# EAGLE schematic RTK_mosaic-X5 (EAGLE 9.6.2)

## Sheet 1 of 2
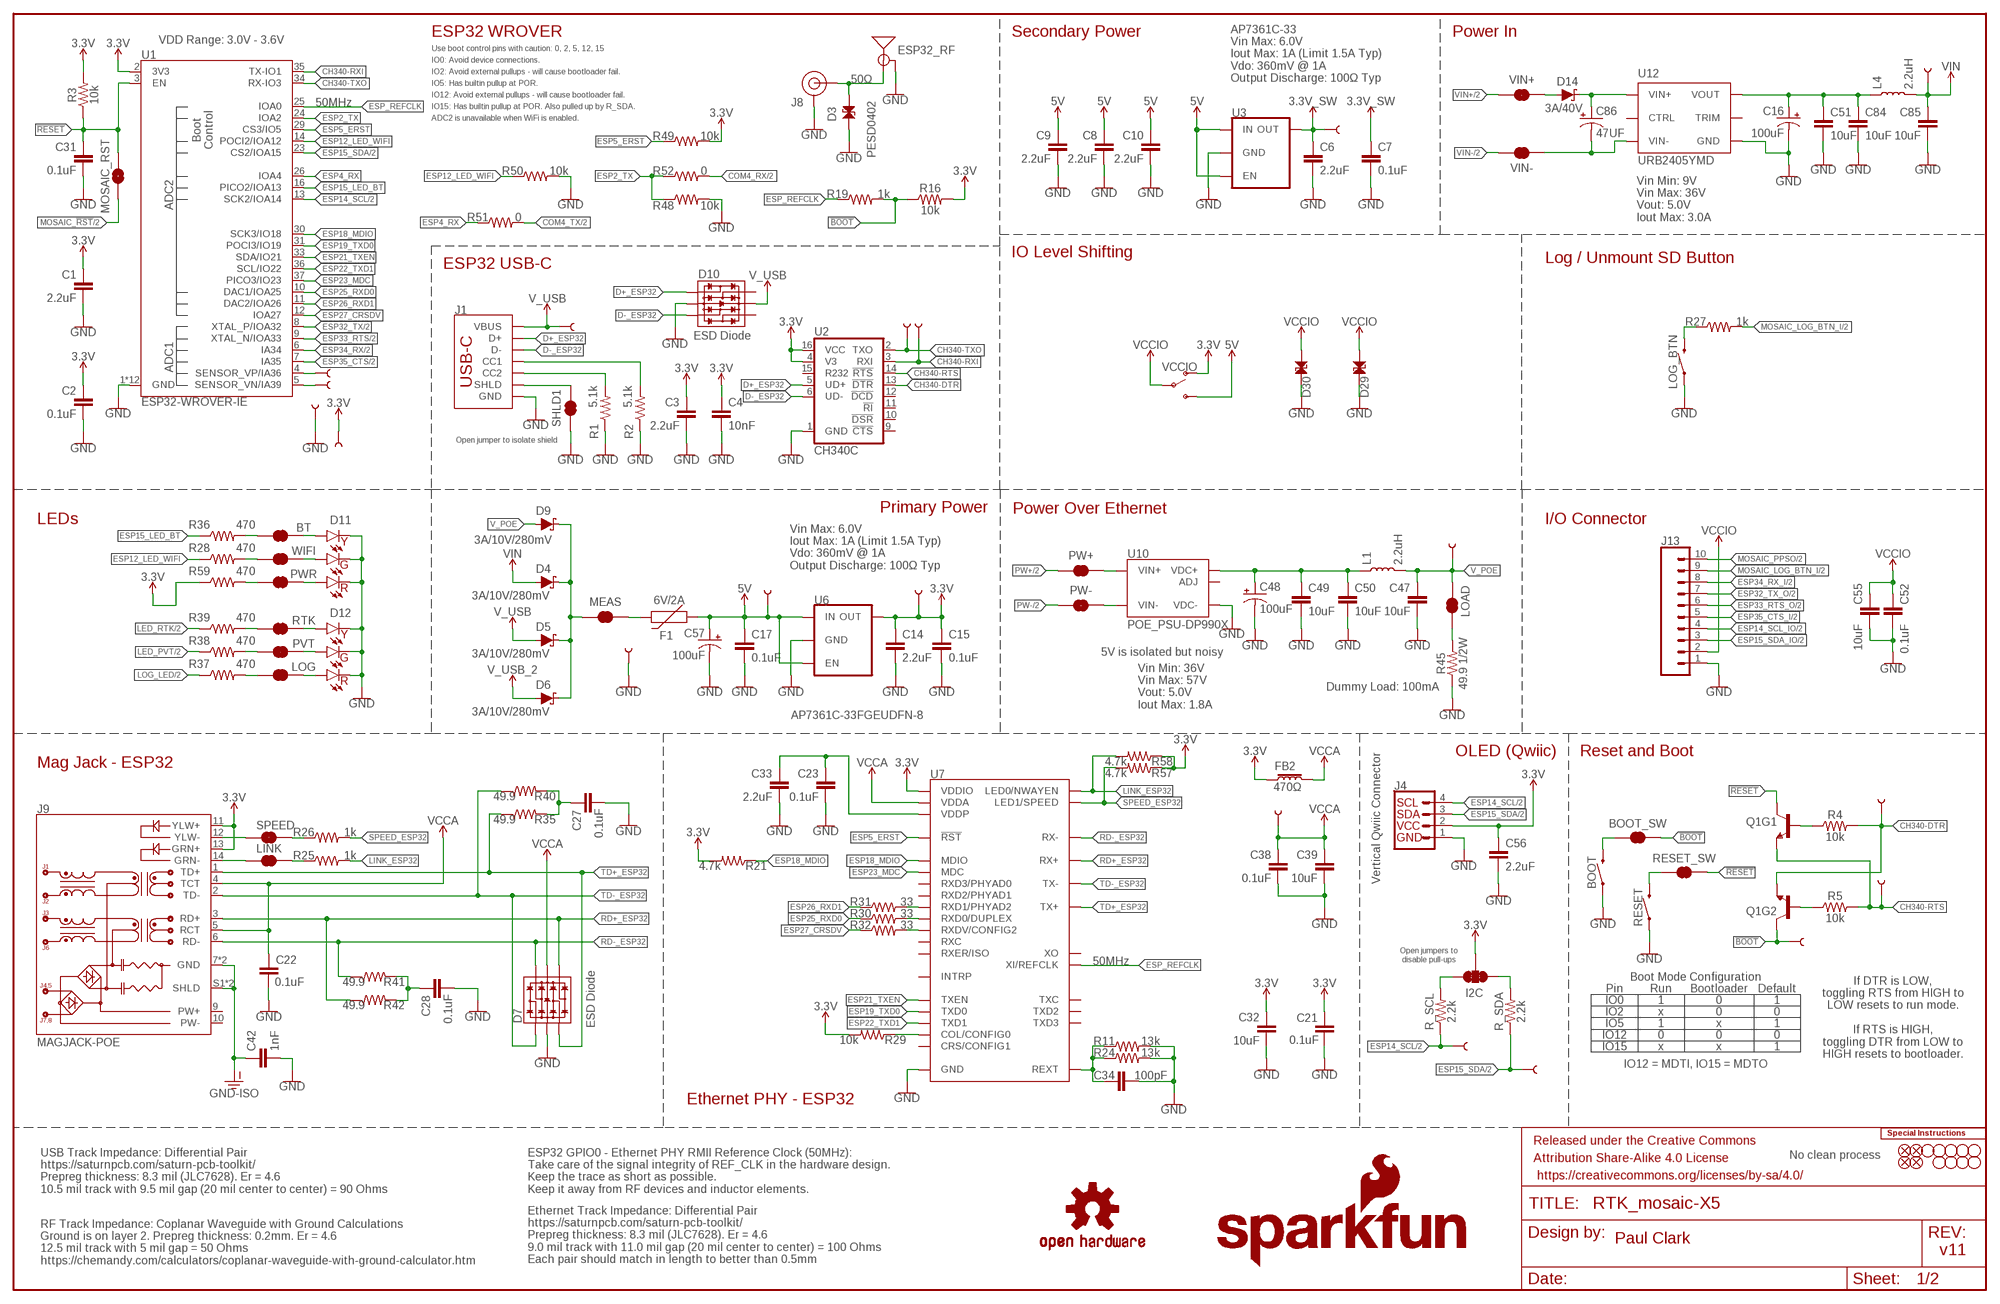
[diagram p0: schematic, sheet 1]

### Parts
3V3  TEST-POINTPOGO_PTH  [1X01_NO_SILK]
3V3_SW  TEST-POINTPOGO_PTH  [1X01_NO_SILK]
5V  TEST-POINTPOGO_PTH  [1X01_NO_SILK]
BOOT  MOMENTARY-SWITCH-SPST-PTH-RIGHT-ANGLE-8-020  [TACTILE_SWITCH_PTH_RA_8-020]
BOOT_SW  JUMPER-SMT_2_NC_TRACE_SILK  [SMT-JUMPER_2_NC_TRACE_SILK]
BT  JUMPER-SMT_2_NC_TRACE_SILK  [SMT-JUMPER_2_NC_TRACE_SILK]
C1  2.2uF  2.2UF-0603-10V-20%  [0603]
C2  0.1uF  0.1UF-0603-25V-5%  [0603]
C3  2.2uF  2.2UF-0603-10V-20%  [0603]
C4  10nF  10NF-0603-50V-10%  [0603]
C6  2.2uF  2.2UF-0603-10V-20%  [0603]
C7  0.1uF  0.1UF-0603-25V-5%  [0603]
C8  2.2uF  2.2UF-0603-10V-20%  [0603]
C9  2.2uF  2.2UF-0603-10V-20%  [0603]
C10  2.2uF  2.2UF-0603-10V-20%  [0603]
C14  2.2uF  2.2UF-0603-10V-20%  [0603]
C15  0.1uF  0.1UF-0603-25V-5%  [0603]
C16  100uF  100UF-POLAR-25V-20%(ELEC)  [PANASONIC_D]
C17  0.1uF  0.1UF-0603-25V-5%  [0603]
C21  0.1uF  0.1UF-0603-25V-5%  [0603]
C22  0.1uF  0.1UF-0603-25V-5%  [0603]
C23  0.1uF  0.1UF-0603-25V-5%  [0603]
C27  0.1uF  0.1UF-0603-25V-5%  [0603]
C28  0.1uF  0.1UF-0603-25V-5%  [0603]
C31  0.1uF  0.1UF-0603-25V-5%  [0603]
C32  10uF  10UF-0603-6.3V-20%  [0603]
C33  2.2uF  2.2UF-0603-10V-20%  [0603]
C34  100pF  100PF-0603-50V-5%  [0603]
C38  0.1uF  0.1UF-0603-25V-5%  [0603]
C39  10uF  10UF-0603-6.3V-20%  [0603]
C42  1nF  1.0NF/1000PF-1206-2KV-10%  [1206]
C47  10uF  10UF-0805-25V-10%  [0805]
C48  100uF  100UF-POLAR-25V-20%(ELEC)  [PANASONIC_D]
C49  10uF  10UF-0805-25V-10%  [0805]
C50  10uF  10UF-0805-25V-10%  [0805]
C51  10uF  10UF-0805-25V-10%  [0805]
C52  0.1uF  0.1UF-0603-25V-5%  [0603]
C55  10uF  10UF-0603-6.3V-20%  [0603]
C56  2.2uF  2.2UF-0603-10V-20%  [0603]
C57  100uF  100UF-POLAR-25V-20%(ELEC)  [PANASONIC_D]
C84  10uF  10UF-0805-25V-10%  [0805]
C85  10uF  10UF-0805-25V-10%  [0805]
C86  47UF  47UF-POLAR-PANASONIC_D-50V-20%  [PANASONIC_D]
D3  PESD0402  PESD0402-0402  [0402]
D4  3A/10V/280mV  DIODE-SCHOTTKY-BAT60A  [SOD-323]
D5  3A/10V/280mV  DIODE-SCHOTTKY-BAT60A  [SOD-323]
D6  3A/10V/280mV  DIODE-SCHOTTKY-BAT60A  [SOD-323]
D7  ESD Diode  TVS_DIODE_ARRAY_DT1042-04SO-7  [SOT-23-6]
D9  3A/10V/280mV  DIODE-SCHOTTKY-BAT60A  [SOD-323]
D10  ESD Diode  TVS_DIODE_ARRAY_DT1042-04SO-7  [SOT-23-6]
D11  Yellow Green Red  LED_TRIPLE-3MM_RIGHT-ANGLE_PTH_YELLOW_GREEN_RED  [CBI_LED_T-3MM_PTH]
D12  Yellow Green Red  LED_TRIPLE-3MM_RIGHT-ANGLE_PTH_YELLOW_GREEN_RED  [CBI_LED_T-3MM_PTH]
D14  3A/40V  DIODE-SCHOTTKY-B340A  [SMA-DIODE]
D29  PESD0402  PESD0402-0402  [0402]
D30  PESD0402  PESD0402-0402  [0402]
DTR  TEST-POINTPOGO_PTH  [1X01_NO_SILK]
ESP1  TEST-POINTPOGO_PTH  [1X01_NO_SILK]
ESP2  TEST-POINTPOGO_PTH  [1X01_NO_SILK]
ESP32_RF  ANTENNA-SMA-GROUNDEDEDGE_RPSMA  [RP-SMA-EDGE]
ESP36  TEST-POINTPOGO_PTH  [1X01_NO_SILK]
ESP39  TEST-POINTPOGO_PTH  [1X01_NO_SILK]
F1  6V/2A  PPTC_6V2A  [1210]
FB2  470Ω  FERRITE_BEAD-0603-470Ω-100MHZ-1A-200MILIΩ  [0603]
FD1  FIDUCIAL1X2  [FIDUCIAL-1X2]
FD2  FIDUCIAL1X2  [FIDUCIAL-1X2]
FD3  FIDUCIAL1X2  [FIDUCIAL-1X2]
FD4  FIDUCIAL1X2  [FIDUCIAL-1X2]
FRAME1  FRAME-LEDGER  [CREATIVE_COMMONS]
GND  TEST-POINTPOGO_PTH  [1X01_NO_SILK]
H1  STAND-OFFTIGHT  [STAND-OFF-TIGHT]
H2  STAND-OFFTIGHT  [STAND-OFF-TIGHT]
H3  STAND-OFFTIGHT  [STAND-OFF-TIGHT]
H4  STAND-OFFTIGHT  [STAND-OFF-TIGHT]
H5  STAND-OFFTIGHT  [STAND-OFF-TIGHT]
H6  STAND-OFFTIGHT  [STAND-OFF-TIGHT]
H7  STAND-OFFTIGHT  [STAND-OFF-TIGHT]
H8  STAND-OFFTIGHT  [STAND-OFF-TIGHT]
H10  STAND-OFFTIGHT  [STAND-OFF-TIGHT]
I2C  JUMPER-SMT_3_2-NC_TRACE_SILK  [SMT-JUMPER_3_2-NC_TRACE_SILK]
J1  USB_C_4-LAYER_PADS  [USB-C-16P_4LAYER-PADS]
J4  Vertical Qwiic Connector  QWIIC_CONNECTOR  [JST04_1MM_VERT]
J8  U.FL2PIN-REDUCED-FOOTPRINT  [U.FL_REDUCED_FOOTPRINT]
J9  MAGJACK-POE  [MAGJACK-SYM_LED]
J13  CONN_10_3.5MM_RA_HEADER  [1X10_SCREW_TERMINAL_3.5MM]
L1  2.2uH  INDUCTOR-0805_WIDE-2.2UH  [0805-WIDE]
L4  2.2uH  INDUCTOR-0805_WIDE-2.2UH  [0805-WIDE]
LINK  JUMPER-SMT_2_NC_TRACE_SILK  [SMT-JUMPER_2_NC_TRACE_SILK]
LOAD  JUMPER-SMT_2_NC_TRACE_SILK  [SMT-JUMPER_2_NC_TRACE_SILK]
LOG  JUMPER-SMT_2_NC_TRACE_SILK  [SMT-JUMPER_2_NC_TRACE_SILK]
LOG_BTN  MOMENTARY-SWITCH-SPST-PTH-RIGHT-ANGLE-8-020  [TACTILE_SWITCH_PTH_RA_8-020]
LOGO1  SPECIAL_INSTRUCTIONS-ORDERING  [ORDERING_INSTRUCTIONS]
LOGO4  OSHW-LOGOS  [OSHW-LOGO-S]
LOGO5  SFE_LOGO_NAME.2_INCH  [SFE_LOGO_NAME_.2]
LOGO6  SFE_LOGO_FLAME.2_INCH  [SFE_LOGO_FLAME_.2]
MEAS  JUMPER-COMBO_2_NC_TRACE  [COMBO-JUMPER_2_NC_TRACE]
MOSAIC_RST  JUMPER-COMBO_2_NO  [COMBO-JUMPER_2_NO]
PVT  JUMPER-SMT_2_NC_TRACE_SILK  [SMT-JUMPER_2_NC_TRACE_SILK]
PW+  JUMPER-COMBO_2_NC_TRACE  [COMBO-JUMPER_2_NC_TRACE]
PW-  JUMPER-COMBO_2_NC_TRACE  [COMBO-JUMPER_2_NC_TRACE]
PWR  JUMPER-SMT_2_NC_TRACE_SILK  [SMT-JUMPER_2_NC_TRACE_SILK]
Q1  TRANS_NPN_DUAL-MBT3904DW1T1  [SC70-6]
R1  5.1k  5.1KOHM5.1KOHM-0603-1/10W-1%  [0603]
R2  5.1k  5.1KOHM5.1KOHM-0603-1/10W-1%  [0603]
R3  10k  10KOHM-0603-1/10W-1%  [0603]
R4  10k  10KOHM-0603-1/10W-1%  [0603]
R5  10k  10KOHM-0603-1/10W-1%  [0603]
R11  13k  13KOHM-0603-1/10W-1%  [0603]
R16  10k  10KOHM-0603-1/10W-1%  [0603]
R19  1k  1KOHM-0603-1/10W-1%  [0603]
R21  4.7k  4.7KOHM-0603-1/10W-1%  [0603]
R24  13k  13KOHM-0603-1/10W-1%  [0603]
R25  1k  1KOHM-0603-1/10W-1%  [0603]
R26  1k  1KOHM-0603-1/10W-1%  [0603]
R27  1k  1KOHM-0603-1/10W-1%  [0603]
R28  470  470OHM-0603-1/10W-1%  [0603]
R29  10k  10KOHM-0603-1/10W-1%  [0603]
R30  33  33OHM-0603-1/10W-1%  [0603]
R31  33  33OHM-0603-1/10W-1%  [0603]
R32  33  33OHM-0603-1/10W-1%  [0603]
R35  49.9  49.9OHM-0603-1/10W-1%  [0603]
R36  470  470OHM-0603-1/10W-1%  [0603]
R37  470  470OHM-0603-1/10W-1%  [0603]
R38  470  470OHM-0603-1/10W-1%  [0603]
R39  470  470OHM-0603-1/10W-1%  [0603]
R40  49.9  49.9OHM-0603-1/10W-1%  [0603]
R41  49.9  49.9OHM-0603-1/10W-1%  [0603]
R42  49.9  49.9OHM-0603-1/10W-1%  [0603]
R45  49.9 1/2W  49.9OHM-1206-1/2W-1%  [1206]
R48  10k  10KOHM-0603-1/10W-1%  [0603]
R49  10k  10KOHM-0603-1/10W-1%  [0603]
R50  10k  10KOHM-0603-1/10W-1%  [0603]
R51  0  0OHM-0603-1/10W  [0603]
R52  0  0OHM-0603-1/10W  [0603]
R57  4.7k  4.7KOHM-0603-1/10W-1%  [0603]
R58  4.7k  4.7KOHM-0603-1/10W-1%  [0603]
R59  470  470OHM-0603-1/10W-1%  [0603]
R_SCL  2.2k  2.2KOHM-0603-1/10W-1%  [0603]
R_SDA  2.2k  2.2KOHM-0603-1/10W-1%  [0603]
RESET  MOMENTARY-SWITCH-SPST-PTH-RIGHT-ANGLE-8-020  [TACTILE_SWITCH_PTH_RA_8-020]
RESET_SW  JUMPER-SMT_2_NC_TRACE_SILK  [SMT-JUMPER_2_NC_TRACE_SILK]
RTK  JUMPER-SMT_2_NC_TRACE_SILK  [SMT-JUMPER_2_NC_TRACE_SILK]
RTS  TEST-POINTPOGO_PTH  [1X01_NO_SILK]
RX  TEST-POINTPOGO_PTH  [1X01_NO_SILK]
SCL2  TEST-POINTPOGO_PTH  [1X01_NO_SILK]
SDA2  TEST-POINTPOGO_PTH  [1X01_NO_SILK]
SHLD1  JUMPER-SMT_2_NC_TRACE_SILK  [SMT-JUMPER_2_NC_TRACE_SILK]
SPEED  JUMPER-SMT_2_NC_TRACE_SILK  [SMT-JUMPER_2_NC_TRACE_SILK]
TP_BOOT  TEST-POINTPOGO_PTH  [1X01_NO_SILK]
TX  TEST-POINTPOGO_PTH  [1X01_NO_SILK]
U1  ESP32-WROVER-IE  ESP32-WROVER-E/IE_IE-N16R8  [ESP32-WROVER-E/IE]
U2  CH340C  [SO016]
U3  AP7361C-33FGEUDFN-8  [UDFN-8]
U6  AP7361C-33FGEUDFN-8  [UDFN-8]
U7  KSZ8041NLI  KSZ8041NL  [MLF55Q-32LD]
U10  POE_PSU-DP990X  [DP990X]
U12  URB2405YMD  URB_YMD-15WR3__URB2405YMD-15WR3  [URB_YMD-15WR3]
VCCA  TEST-POINTPOGO_PTH  [1X01_NO_SILK]
VCCIO  SWITCH-SPDT-SMD-AYZ0202  [SWITCH_DPDT_SMD_AYZ0202]
VIN  TEST-POINTPOGO_PTH  [1X01_NO_SILK]
VIN+  JUMPER-COMBO_2_NC_TRACE  [COMBO-JUMPER_2_NC_TRACE]
VIN-  JUMPER-COMBO_2_NC_TRACE  [COMBO-JUMPER_2_NC_TRACE]
VPOE  TEST-POINTPOGO_PTH  [1X01_NO_SILK]
VUSB  TEST-POINTPOGO_PTH  [1X01_NO_SILK]
WIFI  JUMPER-SMT_2_NC_TRACE_SILK  [SMT-JUMPER_2_NC_TRACE_SILK]

### Nets
3.3V: 3V3.1 C1.1 C2.1 C3.1 C4.1 C14.1 C15.1 C21.1 C32.1 C56.1 ESP2.1 FB2.1 I2C.2 J4.2 J9.11(YLW+) J9.13(GRN+) R3.2 R16.2 R21.2 R29.2 R49.2 R57.1 R58.1 R59.1 U1.2(3V3) U2.4(V3) U2.16(VCC) U6.1(OUT) U7.17(VDDIO) VCCIO.1(O) ; also sheet 2
3.3V_SW: 3V3_SW.1 C6.1 C7.1 U3.1(OUT) ; also sheet 2
5V: 5V.1 C8.1 C9.1 C10.1 C17.1 C57.+ F1.1 U3.5(EN) U3.8(IN) U6.5(EN) U6.8(IN) VCCIO.3(S) ; also sheet 2
5V_RAW: C48.+ C49.1 C50.1 L1.1 U10.1(VDC+) U10.2(VDC+)
5V_RAW1: C16.+ C51.1 C84.1 L4.1 U12.4(VOUT)
!BOOT!: BOOT_SW.1 Q1.6(C) R16.1 R19.2 TP_BOOT.1
!RESET!: C31.1 MOSAIC_RST.2 MOSAIC_RST.4 Q1.3(C) R3.1 RESET_SW.1 U1.3(EN)
CH340-DTR: DTR.1 Q1.1(E) R4.2 U2.13(!DTR)
CH340-RTS: Q1.4(E) R5.2 RTS.1 U2.14(!RTS)
CH340-RXI: TX.1 U1.35(TX-IO1) U2.3(RXI)
CH340-TXO: RX.1 U1.34(RX-IO3) U2.2(TXO)
COM4_RX: R52.2 ; also sheet 2
COM4_TX: R51.2 ; also sheet 2
D+_ESP32: D10.1(IO1) J1.A6(D+) J1.B6(D+) U2.5(UD+)
D-_ESP32: D10.3(IO2) J1.A7(D-) J1.B7(D-) U2.6(UD-)
ESP2_TX: R48.1 R52.1 U1.24(IOA2)
ESP4_RX: R51.1 U1.26(IOA4)
ESP5_ERST: R49.1 U1.29(CS3/IO5) U7.32(!RST!)
ESP12_LED_WIFI: R28.1 R50.1 U1.14(POCI2/IOA12)
ESP14_SCL: J4.4 R_SCL.1 SCL2.1 U1.13(SCK2/IOA14) ; also sheet 2
ESP14_SCL_IO: J13.4 ; also sheet 2
ESP15_LED_BT: R36.1 U1.16(PICO2/IOA13)
ESP15_SDA: J4.3 R_SDA.1 SDA2.1 U1.23(CS2/IOA15) ; also sheet 2
ESP15_SDA_IO: J13.3 ; also sheet 2
ESP18_MDIO: R21.1 U1.30(SCK3/IO18) U7.11(MDIO)
ESP19_TXD0: U1.31(POCI3/IO19) U7.24(TXD0)
ESP21_TXEN: U1.33(SDA/IO21) U7.23(TXEN)
ESP22_TXD1: U1.36(SCL/IO22) U7.25(TXD1)
ESP23_MDC: U1.37(PICO3/IO23) U7.12(MDC)
ESP25_RXD0: R30.1 U1.10(DAC1/IOA25)
ESP26_RXD1: R31.1 U1.11(DAC2/IOA26)
ESP27_CRSDV: R32.1 U1.12(IOA27)
ESP32_RF: D3.1 ESP32_RF.SIG(SIGNAL) J8.FEED(SIGNAL)
ESP32_TX: U1.8(XTAL_P/IOA32) ; also sheet 2
ESP32_TX_O: J13.7 ; also sheet 2
ESP33_RTS: U1.9(XTAL_N/IOA33) ; also sheet 2
ESP33_RTS_O: J13.6 ; also sheet 2
ESP34_RX: U1.6(IA34) ; also sheet 2
ESP34_RX_I: J13.8 ; also sheet 2
ESP35_CTS: U1.7(IA35) ; also sheet 2
ESP35_CTS_I: J13.5 ; also sheet 2
ESP36: ESP36.1 U1.4(SENSOR_VP/IA36)
ESP39: ESP39.1 U1.5(SENSOR_VN/IA39)
ESP_REFCLK: R19.1 U1.25(IOA0) U7.9(XI/REFCLK)
GND: BOOT.1 C1.2 C2.2 C3.2 C4.2 C6.2 C7.2 C8.2 C9.2 C10.2 C14.2 C15.2 C16.- C17.2 C21.2 C22.2 C23.2 C27.2 C28.2 C31.2 C32.2 C33.2 C34.2 C38.2 C39.2 C42.2 C47.2 C48.- C49.2 C50.2 C51.2 C52.2 C55.2 C56.2 C57.- C84.2 C85.2 D3.2 D7.2(VSS) D10.2(VSS) D11.CATHODE_1(YELLOW_CATHODE) D11.CATHODE_2(GREEN_CATHODE) D11.CATHODE_3(RED_CATHODE) D12.CATHODE_1(YELLOW_CATHODE) D12.CATHODE_2(GREEN_CATHODE) D12.CATHODE_3(RED_CATHODE) D29.2 D30.2 ESP1.1 ESP32_RF.GND@0(GND) ESP32_RF.GND@1(GND) ESP32_RF.GND@2(GND) ESP32_RF.GND@3(GND) GND.1 J1.GND J1.GND2(GND) J4.1 J8.1(GND) J8.2(GND) J13.1 LOG_BTN.1 R1.1 R2.1 R11.2 R24.2 R45.1 R48.2 R50.2 RESET.1 SHLD1.1 U1.1(GND) U1.15(GND) U1.38(GND) U1.GND U1.GNDT1(GND) U1.GNDT2(GND) U1.GNDT3(GND) U1.GNDT4(GND) U1.GNDT5(GND) U1.GNDT6(GND) U1.GNDT7(GND) U1.GNDT8(GND) U2.1(GND) U3.4(GND) U3.EP(GND) U6.4(GND) U6.EP(GND) U7.1(GND) U7.GND U10.3(VDC-) U12.6(GND) ; also sheet 2
GND-ISO: C42.1 J9.7(GND) J9.8(GND) J9.S1(SHLD) J9.S2(SHLD) ; also sheet 2
LED_PVT: R38.1 ; also sheet 2
LED_RTK: R39.1 ; also sheet 2
LINK_ESP32: R25.2 R58.2 U7.30(LED0/NWAYEN)
LOG_LED: R37.1 ; also sheet 2
MEAS: D4.C D5.C D6.C D9.C MEAS.2 MEAS.4
MOSAIC_!RST!: MOSAIC_RST.1 MOSAIC_RST.3 ; also sheet 2
MOSAIC_LOG_BTN_I: J13.9 R27.2 ; also sheet 2
MOSAIC_PPSO: J13.10 ; also sheet 2
N$1: J1.B5(CC2) R1.2
N$2: J1.A5(CC1) R2.2
N$3: J9.14(GRN-) LINK.1
N$4: Q1.2(B) R5.1
N$5: Q1.5(B) R4.1
N$7: J9.12(YLW-) SPEED.1
N$10: F1.2 MEAS.1 MEAS.3
N$11: LOG_BTN.2 R27.1
N$12: R26.1 SPEED.2
N$14: I2C.3 R_SCL.2
N$15: I2C.1 R_SDA.2
N$16: LOG.2 R37.2
N$17: D12.ANODE_3(RED_ANODE) LOG.1
N$18: D11.ANODE_2(GREEN_ANODE) WIFI.1
N$19: C27.1 R35.2 R40.2
N$20: C28.1 R41.2 R42.2
N$21: LINK.2 R25.1
N$22: BT.1 D11.ANODE_1(YELLOW_ANODE)
N$23: C23.1 C33.1 U7.2(VDDP)
N$24: C34.1 R11.1 R24.1 U7.10(REXT)
N$25: R29.1 U7.28(COL/CONFIG0)
N$26: BT.2 R36.2
N$27: LOAD.1 R45.2
N$28: RESET.2 RESET_SW.2
N$29: BOOT.2 BOOT_SW.2
N$30: R30.2 U7.16(RXD0/DUPLEX)
N$31: R31.2 U7.15(RXD1/PHYAD2)
N$32: R28.2 WIFI.2
N$35: D12.ANODE_2(GREEN_ANODE) PVT.1
N$36: D12.ANODE_1(YELLOW_ANODE) RTK.1
N$37: R39.2 RTK.2
N$38: PVT.2 R38.2
N$39: R32.2 U7.18(RXDV/CONFIG2)
N$44: PWR.2 R59.2
N$45: D11.ANODE_3(RED_ANODE) PWR.1
PW1+: PW+.1 PW+.3 U10.5(VIN+) U10.6(VIN+)
PW1-: PW-.1 PW-.3 U10.7(VIN-) U10.8(VIN-)
PW+: PW+.2 PW+.4 ; also sheet 2
PW-: PW-.2 PW-.4 ; also sheet 2
RD+_ESP32: D7.4(IO3) J9.3(RD+) R42.1 U7.5(RX+)
RD-_ESP32: D7.6(IO4) J9.6(RD-) R41.1 U7.4(RX-)
SHIELD: J1.SHLD1(SHLD) J1.SHLD2(SHLD) J1.SHLD3(SHLD) J1.SHLD4(SHLD) SHLD1.2
SPEED_ESP32: R26.2 R57.2 U7.31(LED1/SPEED)
TD+_ESP32: D7.3(IO2) J9.1(TD+) R35.1 U7.7(TX+)
TD-_ESP32: D7.1(IO1) J9.2(TD-) R40.1 U7.6(TX-)
V_POE: C47.1 D9.A L1.2 LOAD.2 VPOE.1
V_USB: D5.A D10.5(VCC) J1.VBUS1(VBUS) J1.VBUS2(VBUS) VUSB.1
V_USB_2: D6.A ; also sheet 2
VCCA: C22.1 C38.1 C39.1 D7.5(VCC) FB2.2 J9.4(TCT) J9.5(RCT) U7.3(VDDA) VCCA.1
VCCIO: C52.1 C55.1 D29.1 D30.1 J13.2 VCCIO.2(P) ; also sheet 2
VIN: C85.1 D4.A L4.2 VIN.1
VIN1+: D14.A VIN+.1 VIN+.3
VIN1-: C86.- U12.2(VIN-) VIN-.2 VIN-.4
VIN2+: C86.+ D14.C U12.3(VIN+)
VIN+: VIN+.2 VIN+.4 ; also sheet 2
VIN-: VIN-.1 VIN-.3 ; also sheet 2
Unconnected: D10.4(IO3) D10.6(IO4) J9.9(PW+) J9.10(PW-) U2.9(!CTS) U2.10(!DSR) U2.11(!RI) U2.12(!DCD) U2.15(R232) U7.8(XO) U7.13(RXD3/PHYAD0) U7.14(RXD2/PHYAD1) U7.19(RXC) U7.20(RXER/ISO) U7.21(INTRP) U7.22(TXC) U7.26(TXD2) U7.27(TXD3) U7.29(CRS/CONFIG1) U10.4(ADJ) U12.1(CTRL) U12.5(TRIM)

### Notes on the sheet
- Secondary Power | Power In
- VDD Range: 3.0V - 3.6V | ESP32 WROVER
- Use boot control pins with caution: 0, 2, 5, 12, 15
- IO0: Avoid device connections.
- IO2: Avoid external pullups - will cause bootloader fail.
- AP7361C-33
  Vin Max: 6.0V
  Iout Max: 1A (Limit 1.5A Typ)
  Vdo: 360mV @ 1A
  Output Discharge: 100Ω Typ
- IO5: Has builtin pullup at POR. | 50Ω
- IO12: Avoid external pullups - will cause bootloader fail.
- 50MHz | IO15: Has builtin pullup at POR. Also pulled up by R_SDA.
- ADC2 is unavailable when WiFi is enabled.
- Vin Min: 9V
  Vin Max: 36V
  Vout: 5.0V
  Iout Max: 3.0A
- IO Level Shifting
- Log / Unmount SD Button
- ESP32 USB-C
- Open jumper to isolate shield
- Primary Power | Power Over Ethernet
- LEDs | I/O Connector
- Vin Max: 6.0V
  Iout Max: 1A (Limit 1.5A Typ)
  Vdo: 360mV @ 1A
  Output Discharge: 100Ω Typ
- 5V is isolated but noisy
- Dummy Load: 100mA
- Vin Min: 36V
  Vin Max: 57V
  Vout: 5.0V
  Iout Max: 1.8A
- OLED (Qwiic) | Reset and Boot
- Mag Jack - ESP32
- Open jumpers to
  disable pull-ups
- 50MHz
- Boot Mode Configuration
- If DTR is LOW,
  toggling RTS from HIGH to
  LOW resets to run mode.
  
  If RTS is HIGH,
  toggling DTR from LOW to
  HIGH resets to bootloader.
- Pin | Run | Bootloader | Default
- IO0 | 1 | 0 | 1
- IO2 | x | 0 | 0
- IO5 | 1 | x | 1
- IO12 | 0 | 0 | 0
- IO15 | x | x | 1
- IO12 = MDTI, IO15 = MDTO
- Ethernet PHY - ESP32
- USB Track Impedance: Differential Pair
  https://saturnpcb.com/saturn-pcb-toolkit/
  Prepreg thickness: 8.3 mil (JLC7628). Er = 4.6
  10.5 mil track with 9.5 mil gap (20 mil center to center) = 90 Ohms
- ESP32 GPIO0 - Ethernet PHY RMII Reference Clock (50MHz):
  Take care of the signal integrity of REF_CLK in the hardware design.
  Keep the trace as short as possible.
  Keep it away from RF devices and inductor elements.
- No clean process
- Ethernet Track Impedance: Differential Pair
  https://saturnpcb.com/saturn-pcb-toolkit/
  Prepreg thickness: 8.3 mil (JLC7628). Er = 4.6
  9.0 mil track with 11.0 mil gap (20 mil center to center) = 100 Ohms
  Each pair should match in length to better than 0.5mm
- Paul Clark
- v11
- RF Track Impedance: Coplanar Waveguide with Ground Calculations
  Ground is on layer 2. Prepreg thickness: 0.2mm. Er = 4.6
  12.5 mil track with 5 mil gap = 50 Ohms
  https://chemandy.com/calculators/coplanar-waveguide-with-ground-calculator.htm

## Sheet 2 of 2
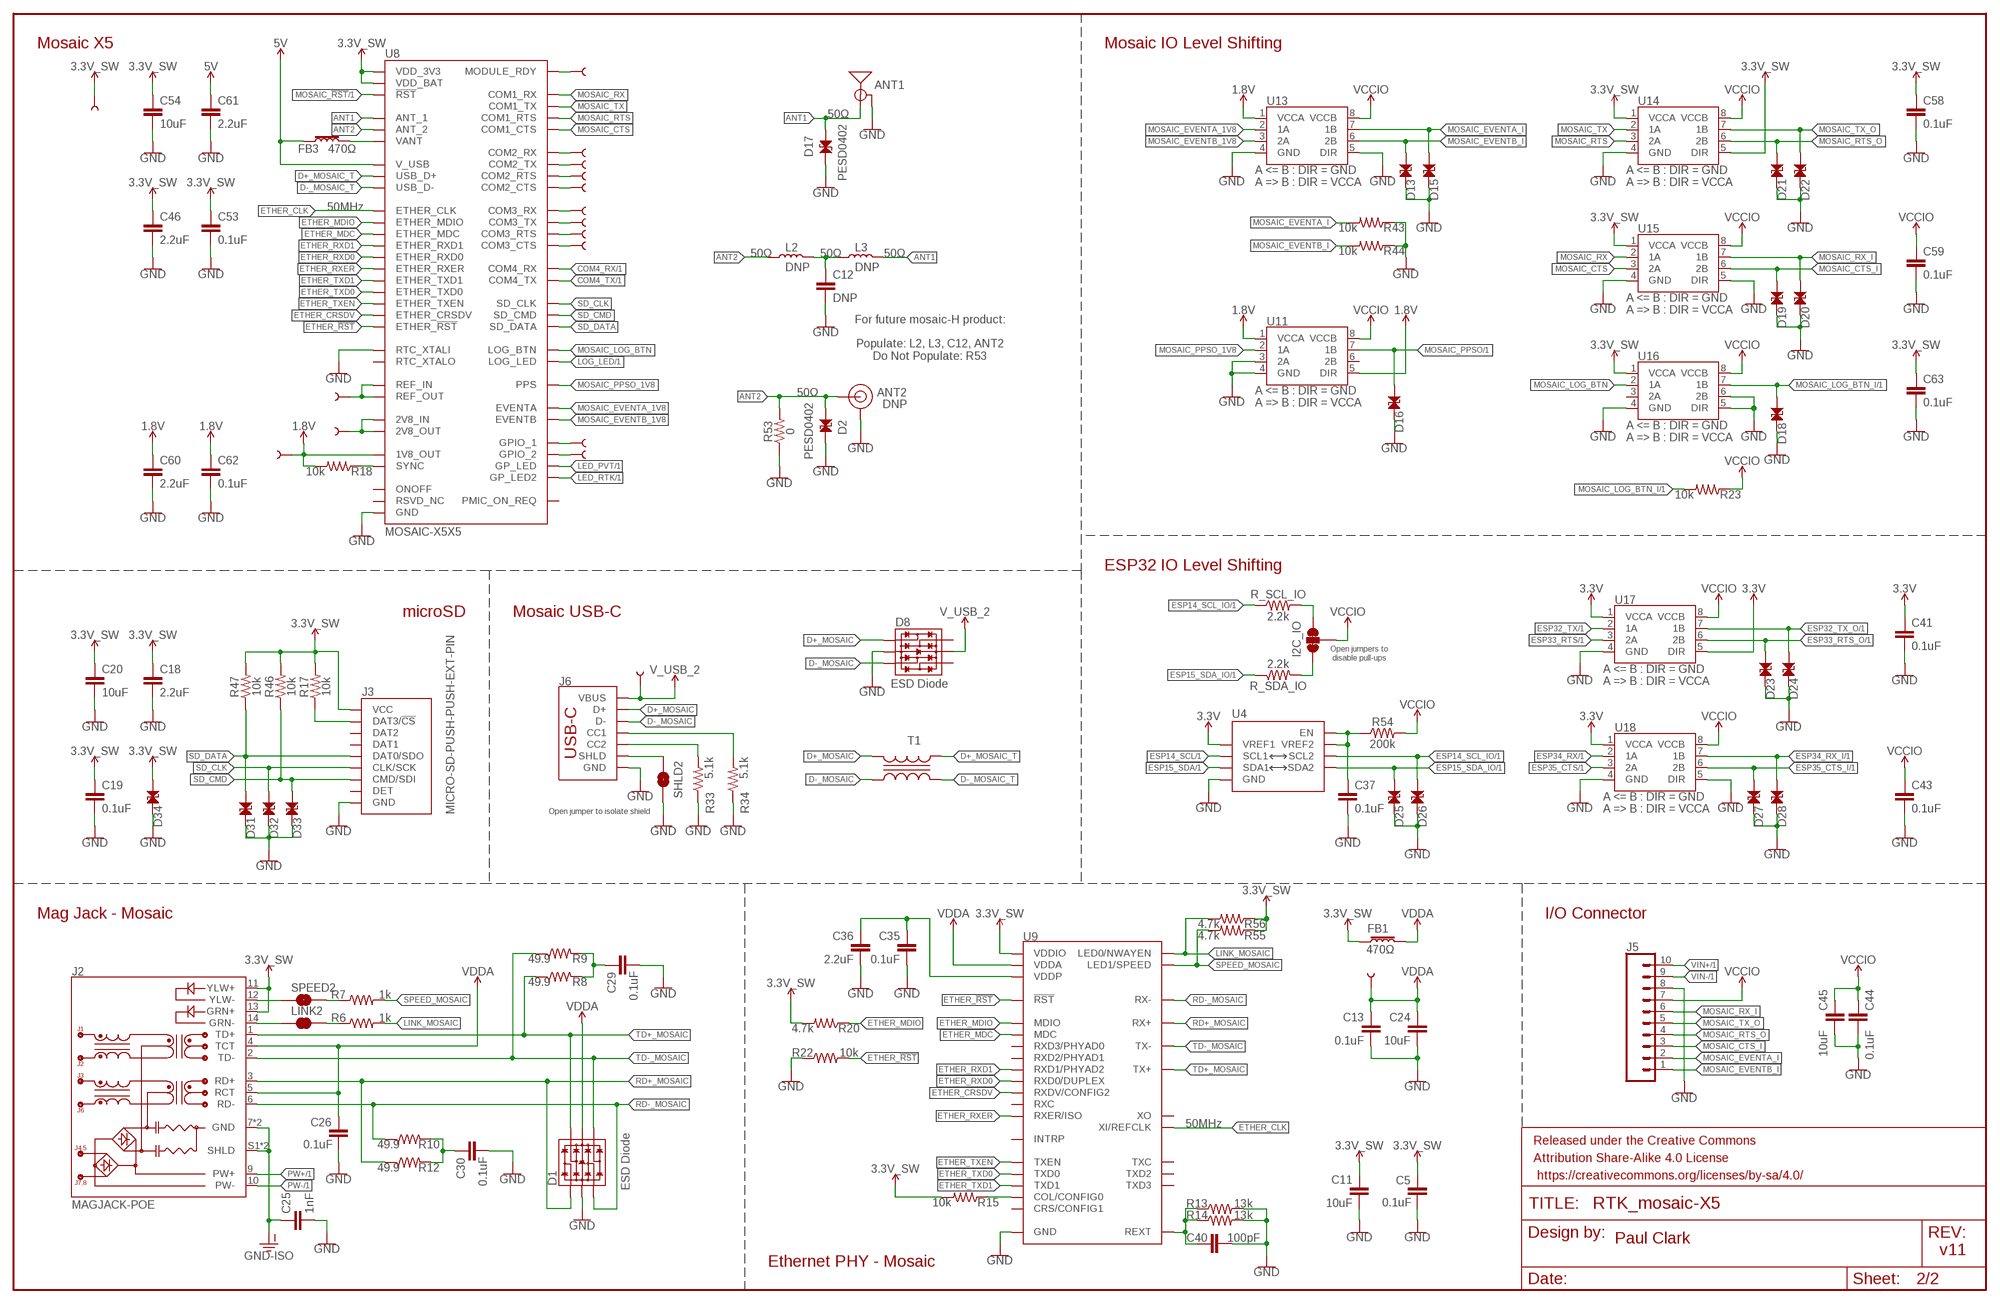
[diagram p1: schematic, sheet 2]

### Parts
1V8  TEST-POINTPOGO_PTH  [1X01_NO_SILK]
2V8  TEST-POINTPOGO_PTH  [1X01_NO_SILK]
ANT1  ANTENNA-SMA-GROUNDEDEDGE_SMA  [SMA-EDGE]
ANT2  DNP  U.FL2PIN-REDUCED__DNP_NO_CREAM  [U.FL_REDUCED_FOOTPRINT__NO_CREAM]
C5  0.1uF  0.1UF-0603-25V-5%  [0603]
C11  10uF  10UF-0603-6.3V-20%  [0603]
C12  DNP  DNP-0603_NO_CREAM  [0603_NO_CREAM]
C13  0.1uF  0.1UF-0603-25V-5%  [0603]
C18  2.2uF  2.2UF-0603-10V-20%  [0603]
C19  0.1uF  0.1UF-0603-25V-5%  [0603]
C20  10uF  10UF-0603-6.3V-20%  [0603]
C24  10uF  10UF-0603-6.3V-20%  [0603]
C25  1nF  1.0NF/1000PF-1206-2KV-10%  [1206]
C26  0.1uF  0.1UF-0603-25V-5%  [0603]
C29  0.1uF  0.1UF-0603-25V-5%  [0603]
C30  0.1uF  0.1UF-0603-25V-5%  [0603]
C35  0.1uF  0.1UF-0603-25V-5%  [0603]
C36  2.2uF  2.2UF-0603-10V-20%  [0603]
C37  0.1uF  0.1UF-0603-25V-5%  [0603]
C40  100pF  100PF-0603-50V-5%  [0603]
C41  0.1uF  0.1UF-0603-25V-5%  [0603]
C43  0.1uF  0.1UF-0603-25V-5%  [0603]
C44  0.1uF  0.1UF-0603-25V-5%  [0603]
C45  10uF  10UF-0603-6.3V-20%  [0603]
C46  2.2uF  2.2UF-0603-10V-20%  [0603]
C53  0.1uF  0.1UF-0603-25V-5%  [0603]
C54  10uF  10UF-0603-6.3V-20%  [0603]
C58  0.1uF  0.1UF-0603-25V-5%  [0603]
C59  0.1uF  0.1UF-0603-25V-5%  [0603]
C60  2.2uF  2.2UF-0603-10V-20%  [0603]
C61  2.2uF  2.2UF-0603-10V-20%  [0603]
C62  0.1uF  0.1UF-0603-25V-5%  [0603]
C63  0.1uF  0.1UF-0603-25V-5%  [0603]
COM2_CTS  TEST-POINTPOGO_PTH  [1X01_NO_SILK]
COM2_RTS  TEST-POINTPOGO_PTH  [1X01_NO_SILK]
COM2_RX  TEST-POINTPOGO_PTH  [1X01_NO_SILK]
COM2_TX  TEST-POINTPOGO_PTH  [1X01_NO_SILK]
COM3_CTS  TEST-POINTPOGO_PTH  [1X01_NO_SILK]
COM3_RTS  TEST-POINTPOGO_PTH  [1X01_NO_SILK]
COM3_RX  TEST-POINTPOGO_PTH  [1X01_NO_SILK]
COM3_TX  TEST-POINTPOGO_PTH  [1X01_NO_SILK]
D1  ESD Diode  TVS_DIODE_ARRAY_DT1042-04SO-7  [SOT-23-6]
D2  PESD0402  PESD0402-0402  [0402]
D8  ESD Diode  TVS_DIODE_ARRAY_DT1042-04SO-7  [SOT-23-6]
D13  PESD0402  PESD0402-0402  [0402]
D15  PESD0402  PESD0402-0402  [0402]
D16  PESD0402  PESD0402-0402  [0402]
D17  PESD0402  PESD0402-0402  [0402]
D18  PESD0402  PESD0402-0402  [0402]
D19  PESD0402  PESD0402-0402  [0402]
D20  PESD0402  PESD0402-0402  [0402]
D21  PESD0402  PESD0402-0402  [0402]
D22  PESD0402  PESD0402-0402  [0402]
D23  PESD0402  PESD0402-0402  [0402]
D24  PESD0402  PESD0402-0402  [0402]
D25  PESD0402  PESD0402-0402  [0402]
D26  PESD0402  PESD0402-0402  [0402]
D27  PESD0402  PESD0402-0402  [0402]
D28  PESD0402  PESD0402-0402  [0402]
D31  PESD0402  PESD0402-0402  [0402]
D32  PESD0402  PESD0402-0402  [0402]
D33  PESD0402  PESD0402-0402  [0402]
D34  PESD0402  PESD0402-0402  [0402]
FB1  470Ω  FERRITE_BEAD-0603-470Ω-100MHZ-1A-200MILIΩ  [0603]
FB3  470Ω  FERRITE_BEAD-0603-470Ω-100MHZ-1A-200MILIΩ  [0603]
FRAME3  FRAME-LEDGERNO_FOOTPRINT  [DUMMY]
GPIO_1  TEST-POINTPOGO_PTH  [1X01_NO_SILK]
GPIO_2  TEST-POINTPOGO_PTH  [1X01_NO_SILK]
I2C_IO  JUMPER-SMT_3_2-NC_TRACE_SILK  [SMT-JUMPER_3_2-NC_TRACE_SILK]
J2  MAGJACK-POE  [MAGJACK-SYM_LED]
J3  MICRO-SD-PUSH-PUSH-EXT-PIN  [MICROSD-EXTERNALPIN]
J5  CONN_10_3.5MM_RA_HEADER  [1X10_SCREW_TERMINAL_3.5MM]
J6  USB_C_4-LAYER_PADS  [USB-C-16P_4LAYER-PADS]
L2  DNP  DNP-0603_NO-CREAM  [0603_NO-CREAM]
L3  DNP  DNP-0603_NO-CREAM  [0603_NO-CREAM]
LINK2  JUMPER-SMT_2_NC_TRACE_SILK  [SMT-JUMPER_2_NC_TRACE_SILK]
R6  1k  1KOHM-0603-1/10W-1%  [0603]
R7  1k  1KOHM-0603-1/10W-1%  [0603]
R8  49.9  49.9OHM-0603-1/10W-1%  [0603]
R9  49.9  49.9OHM-0603-1/10W-1%  [0603]
R10  49.9  49.9OHM-0603-1/10W-1%  [0603]
R12  49.9  49.9OHM-0603-1/10W-1%  [0603]
R13  13k  13KOHM-0603-1/10W-1%  [0603]
R14  13k  13KOHM-0603-1/10W-1%  [0603]
R15  10k  10KOHM-0603-1/10W-1%  [0603]
R17  10k  10KOHM-0603-1/10W-1%  [0603]
R18  10k  10KOHM-0603-1/10W-1%  [0603]
R20  4.7k  4.7KOHM-0603-1/10W-1%  [0603]
R22  10k  10KOHM-0603-1/10W-1%  [0603]
R23  10k  10KOHM-0603-1/10W-1%  [0603]
R33  5.1k  5.1KOHM5.1KOHM-0603-1/10W-1%  [0603]
R34  5.1k  5.1KOHM5.1KOHM-0603-1/10W-1%  [0603]
R43  10k  10KOHM-0603-1/10W-1%  [0603]
R44  10k  10KOHM-0603-1/10W-1%  [0603]
R46  10k  10KOHM-0603-1/10W-1%  [0603]
R47  10k  10KOHM-0603-1/10W-1%  [0603]
R53  0  0OHM-0603-1/10W  [0603]
R54  200k  200KOHM-0603-1/10W-1%  [0603]
R55  4.7k  4.7KOHM-0603-1/10W-1%  [0603]
R56  4.7k  4.7KOHM-0603-1/10W-1%  [0603]
R_SCL_IO  2.2k  2.2KOHM-0603-1/10W-1%  [0603]
R_SDA_IO  2.2k  2.2KOHM-0603-1/10W-1%  [0603]
RDY  TEST-POINTPOGO_PTH  [1X01_NO_SILK]
RDY1  TEST-POINTPOGO_PTH  [1X01_NO_SILK]
REF  TEST-POINTPOGO_PTH  [1X01_NO_SILK]
SHLD2  JUMPER-SMT_2_NC_TRACE_SILK  [SMT-JUMPER_2_NC_TRACE_SILK]
SPEED2  JUMPER-SMT_2_NC_TRACE_SILK  [SMT-JUMPER_2_NC_TRACE_SILK]
T1  TRANSFORMER0508  [RFCMF1220100M4T]
U4  PCA9306VSSOP_8PIN  [VSSOP_8PIN]
U8  MOSAIC-X5X5  [MOSAIC_LGA]
U9  KSZ8041NLI  KSZ8041NL  [MLF55Q-32LD]
U11  74LVC2T45DC  [VSSOP8_(SOT765-1)]
U13  74LVC2T45DC  [VSSOP8_(SOT765-1)]
U14  74LVC2T45DC  [VSSOP8_(SOT765-1)]
U15  74LVC2T45DC  [VSSOP8_(SOT765-1)]
U16  74LVC2T45DC  [VSSOP8_(SOT765-1)]
U17  74LVC2T45DC  [VSSOP8_(SOT765-1)]
U18  74LVC2T45DC  [VSSOP8_(SOT765-1)]
VDDA  TEST-POINTPOGO_PTH  [1X01_NO_SILK]
VUSB2  TEST-POINTPOGO_PTH  [1X01_NO_SILK]

### Nets
1.8V: 1V8.1 C60.1 C62.1 R18.2 U8.AC4(1V8_OUT) U11.1(VCCA) U11.5(DIR) U13.1(VCCA)
2V8: 2V8.1 U8.M23(2V8_IN) U8.N23(2V8_OUT)
3.3V: C41.1 U4.P2(VREF1) U17.1(VCCA) U17.5(DIR) U18.1(VCCA) ; also sheet 1
3.3V_SW: C5.1 C11.1 C18.1 C19.1 C20.1 C46.1 C53.1 C54.1 C58.1 C63.1 D34.1 FB1.1 J2.11(YLW+) J2.13(GRN+) J3.4(VCC) R15.2 R17.2 R20.2 R46.2 R47.2 R55.1 R56.1 RDY1.1 U8.A18(VDD_3V3) U8.A19(VDD_3V3) U8.A20(VDD_3V3) U8.B8(VDD_BAT) U8.B18(VDD_3V3) U8.B19(VDD_3V3) U8.B20(VDD_3V3) U8.C18(VDD_3V3) U8.C19(VDD_3V3) U8.C20(VDD_3V3) U9.17(VDDIO) U14.1(VCCA) U14.5(DIR) U15.1(VCCA) U16.1(VCCA) ; also sheet 1
5V: C61.1 FB3.1 U8.A8(V_USB) ; also sheet 1
ANT1: ANT1.SIG(SIGNAL) D17.1 L3.2 U8.AC20(ANT_1)
ANT2: ANT2.FEED(SIGNAL) D2.1 L2.1 R53.2 U8.V23(ANT_2)
COM2_CTS: COM2_CTS.1 U8.J1(COM2_CTS)
COM2_RTS: COM2_RTS.1 U8.G1(COM2_RTS)
COM2_RX: COM2_RX.1 U8.F1(COM2_RX)
COM2_TX: COM2_TX.1 U8.H1(COM2_TX)
COM3_CTS: COM3_CTS.1 U8.N1(COM3_CTS)
COM3_RTS: COM3_RTS.1 U8.L1(COM3_RTS)
COM3_RX: COM3_RX.1 U8.K1(COM3_RX)
COM3_TX: COM3_TX.1 U8.M1(COM3_TX)
COM4_RX: U8.D3(COM4_RX) ; also sheet 1
COM4_TX: U8.E3(COM4_TX) ; also sheet 1
D+_MOSAIC: D8.1(IO1) J6.A6(D+) J6.B6(D+) T1.A2
D+_MOSAIC_T: T1.A1 U8.A5(USB_D+)
D-_MOSAIC: D8.3(IO2) J6.A7(D-) J6.B7(D-) T1.B2
D-_MOSAIC_T: T1.B1 U8.A6(USB_D-)
ESP14_SCL: U4.P3(SCL1) ; also sheet 1
ESP14_SCL_IO: D26.1 R_SCL_IO.1 U4.P6(SCL2) ; also sheet 1
ESP15_SDA: U4.P4(SDA1) ; also sheet 1
ESP15_SDA_IO: D25.1 R_SDA_IO.1 U4.P5(SDA2) ; also sheet 1
ESP32_TX: U17.2(1A) ; also sheet 1
ESP32_TX_O: D24.1 U17.7(1B) ; also sheet 1
ESP33_RTS: U17.3(2A) ; also sheet 1
ESP33_RTS_O: D23.1 U17.6(2B) ; also sheet 1
ESP34_RX: U18.2(1A) ; also sheet 1
ESP34_RX_I: D28.1 U18.7(1B) ; also sheet 1
ESP35_CTS: U18.3(2A) ; also sheet 1
ESP35_CTS_I: D27.1 U18.6(2B) ; also sheet 1
ETHER_!RST!: R22.2 U8.F2(ETHER_!RST!) U9.32(!RST!)
ETHER_CLK: U8.AA2(ETHER_CLK) U9.9(XI/REFCLK)
ETHER_CRSDV: U8.N2(ETHER_CRSDV) U9.18(RXDV/CONFIG2)
ETHER_MDC: U8.V2(ETHER_MDC) U9.12(MDC)
ETHER_MDIO: R20.1 U8.W2(ETHER_MDIO) U9.11(MDIO)
ETHER_RXD0: U8.R2(ETHER_RXD0) U9.16(RXD0/DUPLEX)
ETHER_RXD1: U8.T2(ETHER_RXD1) U9.15(RXD1/PHYAD2)
ETHER_RXER: U8.M2(ETHER_RXER) U9.20(RXER/ISO)
ETHER_TXD0: U8.J2(ETHER_TXD0) U9.24(TXD0)
ETHER_TXD1: U8.H2(ETHER_TXD1) U9.25(TXD1)
ETHER_TXEN: U8.L2(ETHER_TXEN) U9.23(TXEN)
GND: ANT1.GND@0(GND) ANT1.GND@1(GND) ANT1.GND@2(GND) ANT1.GND@3(GND) ANT2.1(GND) ANT2.2(GND) C5.2 C11.2 C12.2 C13.2 C18.2 C19.2 C20.2 C24.2 C25.2 C26.2 C29.2 C30.2 C35.2 C36.2 C37.2 C40.2 C41.2 C43.2 C44.2 C45.2 C46.2 C53.2 C54.2 C58.2 C59.2 C60.2 C61.2 C62.2 C63.2 D1.2(VSS) D2.2 D8.2(VSS) D13.2 D15.2 D16.2 D17.2 D18.2 D19.2 D20.2 D21.2 D22.2 D23.2 D24.2 D25.2 D26.2 D27.2 D28.2 D31.2 D32.2 D33.2 D34.2 J3.6(GND) J3.10(GND) J3.11(GND) J3.12(GND) J3.13(GND) J5.8 J6.GND J6.GND2(GND) R13.2 R14.2 R22.1 R33.1 R34.1 R43.1 R44.1 R53.1 SHLD2.1 U4.P1(GND) U8.A3(RTC_XTALI) U8.A4(GND) U8.A7(GND) U8.A15(GND) U8.A16(GND) U8.A17(GND) U8.A21(GND) U8.A22(GND) U8.A23(GND) U8.AA13(GND) U8.AA14(GND) U8.AA15(GND) U8.AA16(GND) U8.AA17(GND) U8.AA18(GND) U8.AA19(GND) U8.AA20(GND) U8.AA21(GND) U8.AA22(GND) U8.AA23(GND) U8.AB2(GND) U8.AB3(GND) U8.AB4(GND) U8.AB5(GND) U8.AB6(GND) U8.AB7(GND) U8.AB8(GND) U8.AB13(GND) U8.AB14(GND) U8.AB15(GND) U8.AB16(GND) U8.AB17(GND) U8.AB18(GND) U8.AB19(GND) U8.AB20(GND) U8.AB21(GND) U8.AB22(GND) U8.AB23(GND) U8.AC13(GND) U8.AC15(GND) U8.AC18(GND) U8.AC19(GND) U8.AC21(GND) U8.AC22(GND) U8.AC23(GND) U8.B4(GND) U8.B5(GND) U8.B6(GND) U8.B7(GND) U8.B13(GND) U8.B17(GND) U8.B21(GND) U8.C4(GND) U8.C7(GND) U8.C15(GND) U8.C16(GND) U8.C17(GND) U8.C23(GND) U8.D2(GND) U8.D21(GND) U8.D22(GND) U8.D23(GND) U8.E2(GND) U8.E21(GND) U8.E22(GND) U8.E23(GND) U8.F21(GND) U8.F22(GND) U8.F23(GND) U8.G2(GND) U8.G21(GND) U8.G23(GND) U8.H21(GND) U8.H22(GND) U8.H23(GND) U8.J21(GND) U8.J22(GND) U8.J23(GND) U8.K2(GND) U8.K21(GND) U8.K22(GND) U8.K23(GND) U8.L21(GND) U8.L22(GND) U8.L23(GND) U8.M21(GND) U8.M22(GND) U8.N21(GND) U8.N22(GND) U8.P1(GND) U8.P2(GND) U8.P3(GND) U8.P21(GND) U8.P22(GND) U8.R3(GND) U8.R21(GND) U8.R22(GND) U8.T21(GND) U8.T22(GND) U8.T23(GND) U8.U2(GND) U8.U21(GND) U8.U22(GND) U8.U23(GND) U8.V21(GND) U8.V22(GND) U8.W21(GND) U8.W22(GND) U8.W23(GND) U8.Y2(GND) U8.Y21(GND) U8.Y22(GND) U8.Y23(GND) U9.1(GND) U9.GND U11.3(2A) U11.4(GND) U13.4(GND) U13.5(DIR) U14.4(GND) U15.4(GND) U15.5(DIR) U16.4(GND) U16.5(DIR) U16.6(2B) U17.4(GND) U18.4(GND) U18.5(DIR) ; also sheet 1
GND-ISO: C25.1 J2.7(GND) J2.8(GND) J2.S1(SHLD) J2.S2(SHLD) ; also sheet 1
GPIO_1: GPIO_1.1 U8.AA4(GPIO_1)
GPIO_2: GPIO_2.1 U8.L3(GPIO_2)
LED_PVT: U8.A14(GP_LED) ; also sheet 1
LED_RTK: U8.M3(GP_LED2) ; also sheet 1
LINK_MOSAIC: R6.2 R56.2 U9.30(LED0/NWAYEN)
LOG_LED: U8.B2(LOG_LED) ; also sheet 1
MOSAIC_!RST!: U8.A11(!RST!) ; also sheet 1
MOSAIC_CTS: U8.E1(COM1_CTS) U15.3(2A)
MOSAIC_CTS_I: D19.1 J5.3 U15.6(2B)
MOSAIC_EVENTA_1V8: U8.AC6(EVENTA) U13.2(1A)
MOSAIC_EVENTA_I: D15.1 J5.2 R43.2 U13.7(1B)
MOSAIC_EVENTB_1V8: U8.AC7(EVENTB) U13.3(2A)
MOSAIC_EVENTB_I: D13.1 J5.1 R44.2 U13.6(2B)
MOSAIC_LOG_BTN: U8.K3(LOG_BTN) U16.2(1A)
MOSAIC_LOG_BTN_I: D18.1 R23.2 U16.7(1B) ; also sheet 1
MOSAIC_PPSO: D16.1 U11.7(1B) ; also sheet 1
MOSAIC_PPSO_1V8: U8.AC8(PPS) U11.2(1A)
MOSAIC_RTS: U8.C1(COM1_RTS) U14.3(2A)
MOSAIC_RTS_O: D21.1 J5.4 U14.6(2B)
MOSAIC_RX: U8.B1(COM1_RX) U15.2(1A)
MOSAIC_RX_I: D20.1 J5.6 U15.7(1B)
MOSAIC_TX: U8.D1(COM1_TX) U14.2(1A)
MOSAIC_TX_O: D22.1 J5.5 U14.7(1B)
N$6: C37.1 R54.1 U4.P7(VREF2) U4.P8(EN)
N$8: J6.SHLD1(SHLD) J6.SHLD2(SHLD) J6.SHLD3(SHLD) J6.SHLD4(SHLD) SHLD2.2
N$9: R18.1 U8.AC3(SYNC)
N$13: C12.1 L2.2 L3.1
N$33: J6.B5(CC2) R33.2
N$34: J6.A5(CC1) R34.2
N$40: J2.14(GRN-) LINK2.1
N$41: J2.12(YLW-) SPEED2.1
N$42: I2C_IO.3 R_SCL_IO.2
N$43: I2C_IO.1 R_SDA_IO.2
N$142: R7.1 SPEED2.2
N$143: LINK2.2 R6.1
N$144: C29.1 R8.2 R9.2
N$145: C30.1 R10.2 R12.2
N$146: C35.1 C36.1 U9.2(VDDP)
N$147: C40.1 R13.1 R14.1 U9.10(REXT)
N$148: R15.1 U9.28(COL/CONFIG0)
PW+: J2.9(PW+) ; also sheet 1
PW-: J2.10(PW-) ; also sheet 1
RD+_MOSAIC: D1.1(IO1) J2.3(RD+) R12.1 U9.5(RX+)
RD-_MOSAIC: D1.3(IO2) J2.6(RD-) R10.1 U9.4(RX-)
RDY: RDY.1 U8.A12(MODULE_RDY)
REF: REF.1 U8.AC16(REF_OUT) U8.AC17(REF_IN)
SD_CLK: D32.1 J3.5(CLK/SCK) U8.AA1(SD_CLK)
SD_CMD: D33.1 J3.3(CMD/SDI) R46.1 U8.AB1(SD_CMD)
SD_DAT3: J3.2(DAT3/!CS!) R17.1
SD_DATA: D31.1 J3.7(DAT0/SDO) R47.1 U8.Y1(SD_DATA)
SPEED_MOSAIC: R7.2 R55.2 U9.31(LED1/SPEED)
TD+_MOSAIC: D1.6(IO4) J2.1(TD+) R8.1 U9.7(TX+)
TD-_MOSAIC: D1.4(IO3) J2.2(TD-) R9.1 U9.6(TX-)
V_USB_2: D8.5(VCC) J6.VBUS1(VBUS) J6.VBUS2(VBUS) VUSB2.1 ; also sheet 1
VANT: FB3.2 U8.P23(VANT) U8.R23(VANT)
VCCIO: C43.1 C44.1 C45.1 C59.1 I2C_IO.2 J5.7 R23.1 R54.2 U11.8(VCCB) U13.8(VCCB) U14.8(VCCB) U15.8(VCCB) U16.8(VCCB) U17.8(VCCB) U18.8(VCCB) ; also sheet 1
VDDA: C13.1 C24.1 C26.1 D1.5(VCC) FB1.2 J2.4(TCT) J2.5(RCT) U9.3(VDDA) VDDA.1
VIN+: J5.10 ; also sheet 1
VIN-: J5.9 ; also sheet 1
Unconnected: D8.4(IO3) D8.6(IO4) J3.1(DAT2) J3.8(DAT1) J3.9(DET) U8.A2(RTC_XTALO) U8.A9(RSVD_NC) U8.A10(ONOFF) U8.A13(RSVD_NC) U8.AA3(RSVD_NC) U8.AA5(RSVD_NC) U8.AA6(RSVD_NC) U8.AA7(RSVD_NC) U8.AA8(RSVD_NC) U8.AA9(RSVD_NC) U8.AA10(RSVD_NC) U8.AA11(RSVD_NC) U8.AA12(RSVD_NC) U8.AB9(RSVD_NC) U8.AB10(RSVD_NC) U8.AB11(RSVD_NC) U8.AB12(RSVD_NC) U8.AC1(RSVD_NC) U8.AC2(RSVD_NC) U8.AC5(RSVD_NC) U8.AC9(RSVD_NC) U8.AC10(RSVD_NC) U8.AC11(RSVD_NC) U8.AC12(RSVD_NC) U8.AC14(RSVD_NC) U8.B3(RSVD_NC) U8.B9(RSVD_NC) U8.B10(RSVD_NC) U8.B11(RSVD_NC) U8.B12(RSVD_NC) U8.B14(RSVD_NC) U8.B15(RSVD_NC) U8.B16(PMIC_ON_REQ) U8.B22(RSVD_NC) U8.B23(RSVD_NC) U8.C2(RSVD_NC) U8.C3(RSVD_NC) U8.C5(RSVD_NC) U8.C6(RSVD_NC) U8.C8(RSVD_NC) U8.C9(RSVD_NC) U8.C10(RSVD_NC) U8.C11(RSVD_NC) U8.C12(RSVD_NC) U8.C13(RSVD_NC) U8.C14(RSVD_NC) U8.C21(RSVD_NC) U8.C22(RSVD_NC) U8.F3(RSVD_NC) U8.G3(RSVD_NC) U8.G22(RSVD_NC) U8.H3(RSVD_NC) U8.J3(RSVD_NC) U8.N3(RSVD_NC) U8.R1(RSVD_NC) U8.T1(RSVD_NC) U8.T3(RSVD_NC) U8.U1(RSVD_NC) U8.U3(RSVD_NC) U8.V1(RSVD_NC) U8.V3(RSVD_NC) U8.W1(RSVD_NC) U8.W3(RSVD_NC) U8.Y3(RSVD_NC) U9.8(XO) U9.13(RXD3/PHYAD0) U9.14(RXD2/PHYAD1) U9.19(RXC) U9.21(INTRP) U9.22(TXC) U9.26(TXD2) U9.27(TXD3) U9.29(CRS/CONFIG1) U11.6(2B) U16.3(2A)

### Notes on the sheet
- Mosaic X5 | Mosaic IO Level Shifting
- 50Ω
- 50MHz
- 50Ω | 50Ω | 50Ω
- For future mosaic-H product:
  
  Populate: L2, L3, C12, ANT2
  Do Not Populate: R53
- 50Ω
- ESP32 IO Level Shifting
- microSD | Mosaic USB-C
- Open jumpers to
  disable pull-ups
- Open jumper to isolate shield
- Mag Jack - Mosaic | I/O Connector
- 50MHz
- Paul Clark
- v11
- Ethernet PHY - Mosaic

## Library data of the parts
1V8 2V8 3V3 3V3_SW 5V COM2_CTS COM2_RTS COM2_RX COM2_TX COM3_CTS COM3_RTS COM3_RX COM3_TX DTR ESP1 ESP2 ESP36 ESP39 GND GPIO_1 GPIO_2 RDY RDY1 REF RTS RX SCL2 SDA2 TP_BOOT TX VCCA VDDA VIN VPOE VUSB VUSB2 = SparkFun-Connectors:TEST-POINT: SparkFun Test Points Bare copper test points for troubleshooting or In-Circuit-Testing. These are used by our Production team for verifying production board runs using pogo-pins on test beds. SparkFun Products: SparkFun LSM9DS1 Breakout <https://www.sparkfun.com/products/13284> SparkFun PSOC <https://www.sparkfun.com/products/13714> SparkFun Load Cell Amplifier <https://www.sparkfun.com/products/13879>
ANT1 = SparkFun-RF:ANTENNA-SMA-GROUNDED: SMA Antenna Connector w/ Ground Edge-mount and SMD SMA connectors for RF Antennas. **4-LAYER BOARD WARNING!!** When designing a 4-layer board using any of the SMD variants, you will need to manually add a cutout polygon on any internal power layers to make sure that you don't end up with exposed copper around the edge of the routed hole for these connectors. Exposed power copper could then short to the connector body - and that would be bad. Why hasn't anyone added the cutout polygons directly to the connector footprint? Well, your internal layers (usually 2 and 15) may be covered with GND polygons and you might well want the copper to go all the way to the edge, especially under the connector SIGNAL pin. So adding cutouts to the footprint might make matters worse, not better...; PROD_ID: CONN-08289
ANT2 = SparkFun-Connectors:U.FL2PIN: SMD Antenna Connector - U.FL 2mm height, 3.0mm x 3.0mm receptacle size. SparkFun Products: SparkFun WiFi Shield - ESP8266 <https://www.sparkfun.com/products/13287> SparkFun ESP8266 Thing <https://www.sparkfun.com/products/13231> SparkFun MiniGen - Pro Mini Signal Generator Shield <https://www.sparkfun.com/products/11420>
BOOT LOG_BTN RESET = SparkFun-Switches:MOMENTARY-SWITCH-SPST: Momentary Switch (Pushbutton) - SPST Normally-open (NO) SPST momentary switches (buttons, pushbuttons). Variants PTH-12MM - 12mm square, through-hole Momentary Pushbutton Switch - 12mm Square <https://www.sparkfun.com/products/9190> (COM-09190) PTH-6.0MM, PTH-6.0MM-KIT - 6.0mm square, through-hole Mini Pushbutton Switch <https://www.sparkfun.com/products/97> (COM-00097) KIT package intended for soldering kit's - only one side of pads' copper is exposed. PTH-RIGHT-ANGLE-KIT - Right-angle, through-hole Right Angle Tactile Button <https://www.sparkfun.com/products/10791> - Used on SparkFun BigTime Watch Kit <https://www.sparkfun.com/products/11734> SMD-12MM - 12mm square, surface-mount Tactile Button - SMD (12mm) <https://www.sparkfun.com/products/12993> (COM-12993) Used on SparkFun PicoBoard <https://www.sparkfun.com/products/11888> SMD-4.5MM - 4.5mm Square Trackball Switch Used on SparkFun Blackberry Trackballer Breakout <https://www.sparkfun.com/products/13169> SMD-4.6MMX2.8MM - 4.60mm x 2.80mm, surface mount Used on SparkFun Pro Micro - RP2040 <https://www.sparkfun.com/products/17717> SMD-5.2MM, SMD-5.2-REDUNDANT - 5.2mm square, surface-mount Mini Pushbutton Switch - SMD <https://www.sparkfun.com/products/8720> (COM-08720) Used on Arduino Pro Mini <https://www.sparkfun.com/products/11114> REDUNDANT package connects both switch circuits together SMD-6.0X3.5MM - 6.0 x 3.5mm, surface mount Momentary Reset Switch SMD <https://www.sparkfun.com/products/8229> (COM-08229) SMD-6.2MM-TALL - 6.2mm square, surface mount Tactile Button - SMD (6mm) <https://www.sparkfun.com/products/12992> Used on SparkFun Digital Sandbox <https://www.sparkfun.com/products/12651> SMD-RIGHT-ANGLE - Right-angle, surface mount Used on SparkFun Block for Intel® Edison - Arduino <https://www.sparkfun.com/products/13036>; PROD_ID: SWCH-13896
BOOT_SW BT LINK LINK2 LOAD LOG PVT PWR RESET_SW RTK SHLD1 SHLD2 SPEED SPEED2 WIFI = SparkFun-Jumpers:JUMPER-SMT_2_NC_TRACE: Normally closed trace jumper This jumper has a trace between two pads so it's normally closed (NC). Use a razor knife to open the connection. For best results follow the IPC guidelines for cutting traces: Cutout at least 0.063 mm (0.005 in). Remove all loose material to clean up the cut area. Seal the cut with an approved epoxy. Reapply solder to reclose the connection.
C1 C3 C6 C8-C10 C14 C18 C33 C36 C46 C56 C60 C61 = SparkFun-Capacitors:2.2UF: 2.2µF ceramic capacitors A capacitor is a passive two-terminal electrical component used to store electrical energy temporarily in an electric field.; PROD_ID: CAP-07888
C2 C5 C7 C13 C15 C17 C19 C21-C23 C26-C31 C35 C37 C38 C41 C43 C44 C52 C53 C58 C59 C62 C63 = SparkFun-Capacitors:0.1UF: 0.1µF ceramic capacitors A capacitor is a passive two-terminal electrical component used to store electrical energy temporarily in an electric field.; PROD_ID: CAP-08604
C4 = SparkFun-Capacitors:10NF: 0.01uF/10nF/10,000pF ceramic capacitors A capacitor is a passive two-terminal electrical component used to store electrical energy temporarily in an electric field. CAP-09321; PROD_ID: CAP-00867
C11 C20 C24 C32 C39 C45 C54 C55 = SparkFun-Capacitors:10UF: 10.0µF ceramic capacitors A capacitor is a passive two-terminal electrical component used to store electrical energy temporarily in an electric field.; PROD_ID: CAP-11015
C12 = SparkFun-Capacitors:DNP: Do-Not-Populate capacitor
C16 C48 C57 = SparkFun-Capacitors:100UF-POLAR: 100µF polarized capacitors A capacitor is a passive two-terminal electrical component used to store electrical energy temporarily in an electric field.; PROD_ID: CAP-12547
C25 C42 = SparkFun-Capacitors:1.0NF/1000PF: 1nF/1,000pF ceramic capacitors A capacitor is a passive two-terminal electrical component used to store electrical energy temporarily in an electric field.; PROD_ID: CAP-16238
C34 C40 = SparkFun-Capacitors:100PF: 100pF/0.1nF ceramic capacitors A capacitor is a passive two-terminal electrical component used to store electrical energy temporarily in an electric field.; PROD_ID: CAP-07883
C47 C49-C51 C84 C85 = SparkFun-Capacitors:10UF: 10.0µF ceramic capacitors A capacitor is a passive two-terminal electrical component used to store electrical energy temporarily in an electric field.; PROD_ID: CAP-14259
C86 = SparkFun-Capacitors:47UF-POLAR: 47µF polarized capacitors A capacitor is a passive two-terminal electrical component used to store electrical energy temporarily in an electric field.; PROD_ID: CAP-10547
D1 D7 D8 D10 = SparkFun-DiscreteSemi:TVS_DIODE_ARRAY; PROD_ID: IC-13538
D2 D3 D13 D15-D34 = SparkFun-DiscreteSemi:PESD0402: ESD protection diode PESD is used to protect a signal line from ESD.; DIGIKEY_PART: PESD0402-140CT-ND; MOUSE_PART: 650-PESD0402-140; PROD_ID: DIO-15359
D4-D6 D9 = SparkFun-DiscreteSemi:DIODE-SCHOTTKY: Schottky diode A Schottky diode is a semiconductor diode which has a low forward voltage drop and a very fast switching action.; PROD_ID: DIO-14072
D11 D12 = CBI_LED_TRIPLE-3MM:LED_TRIPLE-3MM_RIGHT-ANGLE_PTH: CBI LED Triple-3mm, Right Angle, PTH E.g.: LUMEX SSF-LXH340LYGID; PROD_ID: DIO-19990
D14 = SparkFun-DiscreteSemi:DIODE-SCHOTTKY: Schottky diode A Schottky diode is a semiconductor diode which has a low forward voltage drop and a very fast switching action.; PROD_ID: DIO-09886; VALUE: 3A/40V/500mV
ESP32_RF = SparkFun-RF:ANTENNA-SMA-GROUNDED: SMA Antenna Connector w/ Ground Edge-mount and SMD SMA connectors for RF Antennas. **4-LAYER BOARD WARNING!!** When designing a 4-layer board using any of the SMD variants, you will need to manually add a cutout polygon on any internal power layers to make sure that you don't end up with exposed copper around the edge of the routed hole for these connectors. Exposed power copper could then short to the connector body - and that would be bad. Why hasn't anyone added the cutout polygons directly to the connector footprint? Well, your internal layers (usually 2 and 15) may be covered with GND polygons and you might well want the copper to go all the way to the edge, especially under the connector SIGNAL pin. So adding cutouts to the footprint might make matters worse, not better...; PROD_ID: CONN-00827
F1 = SparkFun-Fuses:PPTC: Resettable Fuse PPTC Resettable Fuse. Really a sort of resistor with a polymeric positive temperature coefficient whose resistance increases dramatically with an increase in temperature. When heated by the power passing through the resistance rises causing the current to be limited, protecting the circuit. This is achieved by the transition of the polymer from a crystalline to an amorphous state where the conductive carbon separates breaking the conductive pathways found in the cool crystalline structure. When a PPTC cools back down it resumes conducting letting the circuit turn back on. SparkFun Products: SparkFun RedBoard - Programmed with Arduino <https://www.sparkfun.com/products/12757> Pro Micro - 5V/16MHz <https://www.sparkfun.com/products/12640> Arduino Pro 328 - 5V/16MHz <https://www.sparkfun.com/products/10915> MP3 Trigger <https://www.sparkfun.com/products/13720>; PROD_ID: RES-14313
FB1-FB3 = SparkFun-Coils:FERRITE_BEAD: Ferrite Bead (blocks, cores, rings, chokes, etc.) Inductor with layers of ferrite used to suppress high frequencies. Often used to isolate high frequency noise. SparkFun Products: IOIO-OTG - V2.2 <https://www.sparkfun.com/products/13613> SparkFun SAMD21 Mini Breakout <https://www.sparkfun.com/products/13664> SparkFun 6 Degrees of Freedom Breakout - LSM6DS3 <https://www.sparkfun.com/products/13339> SparkFun SAMD21 Dev Breakout <https://www.sparkfun.com/products/13672> Lilypad MP3 <https://www.sparkfun.com/products/11013>; PROD_ID: NDUC-12579
FD1-FD4 = SparkFun-Aesthetics:FIDUCIAL: Fiducial Alignment Points Point-of-reference for pick-and-place machines and other optical instruments.
FRAME1 FRAME3 = SparkFun-Aesthetics:FRAME-LEDGER: Schematic Frame - Ledger Standard 11x14 US Ledger frame
H1-H8 H10 = SparkFun-Hardware:STAND-OFF: Stand Off Drill holes for mechanically mounting via screws, standoffs, etc. Note: Use the keepout ring to avoid running the screw head into surrounding components. Variant Overviews STAND-OFF - Mechanical footprint for a #4 phillips button head screw. STAND-OFF-TIGHT - Mechanical footprint for a #4 phillips button head screw, Example SparkFun Products Screw - Phillips Head (1/4", 4-40, 10 pack) <https://www.sparkfun.com/products/10453> (PRT-10453) Screw - Phillips Head (1/2", 4-40, 10 pack) <https://www.sparkfun.com/products/10452> (PRT-10452) Screw - Phillips Head (3/4", 4-40, 10 pack) <https://www.sparkfun.com/products/10451> (PRT-10451) Screw - Phillips Head (1", 4-40, 10 pack) <https://www.sparkfun.com/products/10450> (PRT-10450)
I2C I2C_IO = SparkFun-Jumpers:JUMPER-SMT_3_2-NC_TRACE: Normally closed trace jumper (2 of 2 connections) This jumper has a trace between all three pads so they are normally closed (NC). Use a razor knife to open the connection(s). For best results follow the IPC guidelines for cutting traces: Cutout at least 0.063 mm (0.005 in). Remove all loose material to clean up the cut area. Seal the cut with an approved epoxy. Reapply solder to reclose the connection(s).
J1 J6 = SparkFun-Connectors:USB_C: USB Type C 16Pin Connector Super Speed pins not available on the 16-pin purely SMD connector so this part is best for USB 2.0 implementations. D1 and D2 are tied together enabling D+/- no matter which way the cable is plugged into the connector. The two channel configuration pins (CC1/2) are exposed. These are normally connected to ground via 5.1k resistors but can be reconfigured for high current/high power applications. **4-LAYER BOARD WARNING!!** If designing 4-layer board, make sure to select the variant _4-LAYER-ISOLATED. The linked footprint (USB-C-16-4LAYER-ISOLATED) includes some very necessary cutout polygons in the inner layers (2 and 15). This prevents the PTH mounting shield legs on the USB connector from electrically connecting any other polygons on the inner layers (usually VCC and GND).; PROD_ID: CONN-14122
J2 J9 = SparkFun-Connectors:MAGJACK-POE: MAGJACK: RJ-45 with POE and LEDs This is a single port, RJ45 ethernet jacks with built in transformer (magnetics), PoE rectifier diodes, status LEDs, and shielding.; PROD_ID: CONN-16253
J3 = SparkFun-Connectors:MICRO-SD: microSD Socket for Transflash Various sockets for µSD. tDoc lines correctly indicate media card edge positions when inserting (unlocked, locked, depressed). NOTE: CD1 and CD2 are connected internally, and the default detect state of the socket is detect pin to ground. SparkFun Products: WAV Trigger <https://www.sparkfun.com/products/13660> CAN-Bus Shield <https://www.sparkfun.com/products/13262> SparkFun Level Shifing microSD Breakout <https://www.sparkfun.com/products/13743>; PROD_ID: CONN-16110
J4 = SparkFun-Connectors:QWIIC_CONNECTOR: SparkFun I2C Standard Qwiic Connector An SMD 1mm pitch JST connector makes it easy and quick (get it? Qwiic?) to connect I2C devices to each other. The Qwiic system <http://www.sparkfun.com/qwiic> enables fast and solderless connection between popular platforms and various sensors and actuators. We carry 200mm <https://www.sparkfun.com/products/14204>, 100mm <https://www.sparkfun.com/products/14205>, 50mm <https://www.sparkfun.com/products/14206>, and breadboard friendly <https://www.sparkfun.com/products/14207> Qwiic cables. We also offer 10 pcs strips <https://www.sparkfun.com/products/14323> the SMD connectors.; PROD_ID: CONN-14483
J5 J13 = SparkFun-Connectors:CONN_10: Multi connection point. Often used as Generic Header-pin footprint for 0.1 inch spaced/style header connections On any of the 0.1 inch spaced packages, you can populate with these: Break Away Headers - Straight <https://www.sparkfun.com/products/116> (PRT-00116) Break Away Male Headers - Right Angle <https://www.sparkfun.com/products/553> (PRT-00553) Female Headers <https://www.sparkfun.com/products/115> (PRT-00115) Break Away Headers - Machine Pin <https://www.sparkfun.com/products/117> (PRT-00117) Break Away Female Headers - Swiss Machine Pin <https://www.sparkfun.com/products/743> (PRT-00743) Arduino Stackable Header - 10 Pin <https://www.sparkfun.com/products/11376> (PRT-11376) For SCREWTERMINALS and SPRING TERMINALS visit here: Screw Terimnals on SparkFun.com <https://www.sparkfun.com/search/results?term=Screw+Terminals> (5mm/3.5mm/2.54mm spacing) This device is also useful as a general connection point to wire up your design to another part of your project. Our various solder wires solder well into these plated through hole pads. Hook-Up Wire - Assortment (Stranded, 22 AWG) <https://www.sparkfun.com/products/11375> (PRT-11375) Hook-Up Wire - Assortment (Solid Core, 22 AWG) <https://www.sparkfun.com/products/11367> (PRT-11367) View the entire wire category on our website here <https://www.sparkfun.com/categories/141> Special notes: Molex polarized connector foot print use with SKU : PRT-08231 with associated crimp pins and housings. 1MM SMD Version SKU: PRT-10208 NOTES ON THE VARIANTS LOCK and LOCK_LONGPADS... This footprint was designed to help hold the alignment of a through-hole component (i.e. 6-pin header) while soldering it into place. You may notice that each hole has been shifted either up or down by 0.005 of an inch from it's more standard position (which is a perfectly straight line). This slight alteration caused the pins (the squares in the middle) to touch the edges of the holes. Because they are alternating, it causes a "brace" to hold the component in place. 0.005 has proven to be the perfect amount of "off-center" position when using our standard breakaway headers. Although looks a little odd when you look at the bare footprint, once you have a header in there, the alteration is very hard to notice. Also,if you push a header all the way into place, it is covered up entirely on the bottom side.; PROD_ID: CONN-17279; STOREFRONT: PRT-21328
J8 = SparkFun-Connectors:U.FL2PIN: SMD Antenna Connector - U.FL 2mm height, 3.0mm x 3.0mm receptacle size. SparkFun Products: SparkFun WiFi Shield - ESP8266 <https://www.sparkfun.com/products/13287> SparkFun ESP8266 Thing <https://www.sparkfun.com/products/13231> SparkFun MiniGen - Pro Mini Signal Generator Shield <https://www.sparkfun.com/products/11420>; PROD_ID: CONN-09193
L1 L4 = SparkFun-Coils:INDUCTOR: Inductors Resist changes in electrical current. Basically a coil of wire. SparkFun Products: SparkFun Load Cell Amplifier - HX711 <https://www.sparkfun.com/products/13879> IOIO-OTG - V2.2 <https://www.sparkfun.com/products/13613>; PROD_ID: NDUC-14234
L2 L3 = SparkFun-Coils:DNP
LOGO1 = SparkFun-Aesthetics:SPECIAL_INSTRUCTIONS: Special Ordering/Production Instructions Alert Symbol for special PCB ordering instructions or unique production process warnings. Ordering Instructions Production Instructions Types of information that should be added to box: Copper weight Soldermask color Silk color PCB thickness Number of layers PCB Standard: 1.6mm FR4 1 oz copper immersion silver plating red soldermask white silkscreen Types of information that should be added to box: Special wash requirements Depaneling instructions Humidification Glue curing Default text settings: 0.07 inch 9% ratio 50% line distance
LOGO4 = SparkFun-Aesthetics:OSHW-LOGO: Open-Source Hardware (OSHW) Logo This logo indicates the piece of hardware it is found on incorporates a OSHW license and/or adheres to the definition of open source hardware found here: http://freedomdefined.org/OSHW
LOGO5 = SparkFun-Aesthetics:SFE_LOGO_NAME: SparkFun Font Logo This is the SparkFun name logo. The logo on the schematic will always be the same size; the package variant is the height of the flame part of the logo (or the height the flame would be, if it were drawn). Default layer for the logo on the board is tSilk.
LOGO6 = SparkFun-Aesthetics:SFE_LOGO_FLAME: SparkFun Flame Logo This is the SparkFun flame logo. The logo on the schematic will always be the same size; the package variant is the height of the flame. Default layer for the logo on the board is tSilk.
MEAS PW+ PW- VIN+ VIN- = SparkFun-Jumpers:JUMPER-COMBO_2_NC_TRACE
MOSAIC_RST = SparkFun-Jumpers:JUMPER-COMBO_2_NO
Q1 = SparkFun-DiscreteSemi:TRANS_NPN_DUAL: Dual NPN Transistors in Single Package The MBT3904W1 puts two general purpose 3904 NPN transistors in a single package. Datasheet <http://www.onsemi.com/pub_link/Collateral/MBT3904DW1T1-D.PDF> SparkFun Products: SparkFun ESP32 Thing <https://www.sparkfun.com/products/13907>; PROD_ID: TRANS-13337
R1 R2 R33 R34 = SparkFun-Resistors:5.1KOHM; PROD_ID: RES-12083
R3-R5 R15-R18 R22 R23 R29 R43 R44 R46-R50 = SparkFun-Resistors:10KOHM: 10kΩ resistor A resistor is a passive two-terminal electrical component that implements electrical resistance as a circuit element. Resistors act to reduce current flow, and, at the same time, act to lower voltage levels within circuits. - Wikipedia; PROD_ID: RES-00824
R6 R7 R19 R25-R27 = SparkFun-Resistors:1KOHM: 1kΩ resistor A resistor is a passive two-terminal electrical component that implements electrical resistance as a circuit element. Resistors act to reduce current flow, and, at the same time, act to lower voltage levels within circuits. - Wikipedia; PROD_ID: RES-07856
R8-R10 R12 R35 R40-R42 = SparkFun-Resistors:49.9OHM: 49.9Ω resistor A resistor is a passive two-terminal electrical component that implements electrical resistance as a circuit element. Resistors act to reduce current flow, and, at the same time, act to lower voltage levels within circuits. - Wikipedia; PROD_ID: RES-16237
R11 R13 R14 R24 = SparkFun-Resistors:13KOHM: 13kΩ resistor A resistor is a passive two-terminal electrical component that implements electrical resistance as a circuit element. Resistors act to reduce current flow, and, at the same time, act to lower voltage levels within circuits. - Wikipedia; PROD_ID: RES-14017
R20 R21 R55-R58 = SparkFun-Resistors:4.7KOHM: 4.7kΩ resistor A resistor is a passive two-terminal electrical component that implements electrical resistance as a circuit element. Resistors act to reduce current flow, and, at the same time, act to lower voltage levels within circuits. - Wikipedia; PROD_ID: RES-07857
R28 R36-R39 R59 = SparkFun-Resistors:470OHM: 470Ω resistor A resistor is a passive two-terminal electrical component that implements electrical resistance as a circuit element. Resistors act to reduce current flow, and, at the same time, act to lower voltage levels within circuits. - Wikipedia; PROD_ID: RES-07869
R30-R32 = SparkFun-Resistors:33OHM: 33Ω resistor A resistor is a passive two-terminal electrical component that implements electrical resistance as a circuit element. Resistors act to reduce current flow, and, at the same time, act to lower voltage levels within circuits. - Wikipedia; PROD_ID: RES-08270
R45 = SparkFun-Resistors:49.9OHM: 49.9Ω resistor A resistor is a passive two-terminal electrical component that implements electrical resistance as a circuit element. Resistors act to reduce current flow, and, at the same time, act to lower voltage levels within circuits. - Wikipedia; PROD_ID: RES-16252
R51-R53 = SparkFun-Resistors:0OHM: 0Ω resistor A resistor is a passive two-terminal electrical component that implements electrical resistance as a circuit element. Resistors act to reduce current flow, and, at the same time, act to lower voltage levels within circuits. - Wikipedia; PROD_ID: RES-08609
R54 = SparkFun-Resistors:200KOHM: 200kΩ resistor A resistor is a passive two-terminal electrical component that implements electrical resistance as a circuit element. Resistors act to reduce current flow, and, at the same time, act to lower voltage levels within circuits. - Wikipedia; PROD_ID: RES-09385
R_SCL R_SCL_IO R_SDA R_SDA_IO = SparkFun-Resistors:2.2KOHM: 2.2kΩ resistor A resistor is a passive two-terminal electrical component that implements electrical resistance as a circuit element. Resistors act to reduce current flow, and, at the same time, act to lower voltage levels within circuits. - Wikipedia; PROD_ID: RES-08272
T1 = SparkFun-Coils:TRANSFORMER: Small transformers; PROD_ID: COMP-19495
U1 = SparkFun-RF:ESP32-WROVER-E/IE: ESP32-WROVER-E/IE ESP32-WROVER-E uses the onboard antenna. ESP32-WROVER-IE has a u.FL antenna connector, but is otherwise the same as the -E. N16R8 has 16M Flash, 8M PSRAM; PROD_ID: IC-19265
U2 = SparkFun-IC-Comms:CH340C; PROD_ID: IC-14038
U3 U6 = SparkFun-IC-Power:AP7361C-33FGE: AP7361C 3.3V LDO Regulator; PROD_ID: VREG-14094
U4 = SparkFun-IC-Comms:PCA9306: Bidirectional I2C level shifter Not compatible with all available part number pinout schemes- DOUBLE CHECK!!! Variants PCA9306DC and PSOP-8 are EOL. If your part has VREF as pin 1 then this is your variant. VSSOP_8PIN is not EOL. Datasheet <https://cdn.sparkfun.com/datasheets/BreakoutBoards/PCA9306DC.pdf> SparkFun Products SparkFun Inventor's Kit for RedBot <https://www.sparkfun.com/products/12649> (ROB-12649) SparkFun RedBot Basic Kit <https://www.sparkfun.com/products/13166> (ROB-13166) SparkFun Level Translator Breakout - PCA9306 <https://www.sparkfun.com/products/11955> (BOB-11955) SparkFun Block for Intel Edison - ADC <https://www.sparkfun.com/products/13770> (DEV-13770) SparkFun Block for Intel® Edison - Raspberry Pi B <https://www.sparkfun.com/products/13044> (DEV-13044) SparkFun RedBot Sensor - Accelerometer <https://www.sparkfun.com/products/12589> (SEN-12589); PROD_ID: IC-14450
U7 U9 = Septentrio_mosaic-X5:KSZ8041NL; PROD_ID: IC-19428
U8 = Septentrio_mosaic-X5:MOSAIC-X5; PROD_ID: GPS-19395
U10 = SparkFun-IC-Power:POE_PSU: A special function Power Over Ethernet module with 5V or 12V output. Comes in an SMD package.; PROD_ID: IC-16251
U11 U13-U18 = 74LVC2T45DC:74LVC2T45: nexperia, 74LVC2T45, Dual supply translating transceiver, 3-state Source: product page <https://www.nexperia.com/products/analog-logic-ics/voltage-translators-level-shifters/74LVC2T45DC.html>, datasheet <https://assets.nexperia.com/documents/data-sheet/74LVC_LVCH2T45.pdf>; PROD_ID: IC-19989
U12 = SparkFun-IC-Power:URB_YMD-15WR3: MORNSUN DC/DC Converter URB_YMD-15WR3 URB2405YMD-15WR3: Input 24V (9V-36V), Output 5.0V 3.0A; PROD_ID: COMP-19263
VCCIO = SparkFun-Switches:SWITCH-SPDT: Single Pole, Double Throw (SPDT) Switch Single-pole, double-throw (SPDT) switch. Variant Overview SMD-AYZ0202 Surface Mount DPDT Switch <https://www.sparkfun.com/products/597> (COM-00597) Used on e.g. LilyPad Arduino USB - ATmega32U4 Board <https://www.sparkfun.com/products/12049> PTH-11.6X4.0MM SPDT Mini Power Switch <https://www.sparkfun.com/products/102> (COM-00102) Used on e.g. SparkFun Simon Says - Through-Hole Soldering Kit <https://www.sparkfun.com/products/10547> (KIT-10547) PTH-11.6X4.0MM-KIT KIT version of SPDT Mini Power Switch - Simplifies soldering by removing tStop of switch pins - only one side can be soldered. PTH-11.6X4.0MM-LOCK LOCK version of SPDT Mini Power Switch - Offset pins hold switch in place for easier soldering. SMD-RIGHT-ANGLE Surface Mount Right Angle Switch <https://www.sparkfun.com/products/10860> (COM-10860) Used on e.g. SparkFun ESP8266 Thing <https://www.sparkfun.com/products/13231>; PROD_ID: SWCH-08179; SF_ID: COM-00597

## Net classes
2 3.3V: width 0.508 mm
3 RF_IN: width 0.35 mm, clearance 0.46 mm
4 USB: width 0.203 mm, clearance 0.127 mm
7 V_ZED: width 0.2 mm, clearance 0.2 mm
8 V_RF: width 0.2 mm
11 ZED_DIG: width 0.1 mm, clearance 0.1 mm